# EAGLE schematic ThrusterShieldV1.1 (EAGLE 6.6.0)
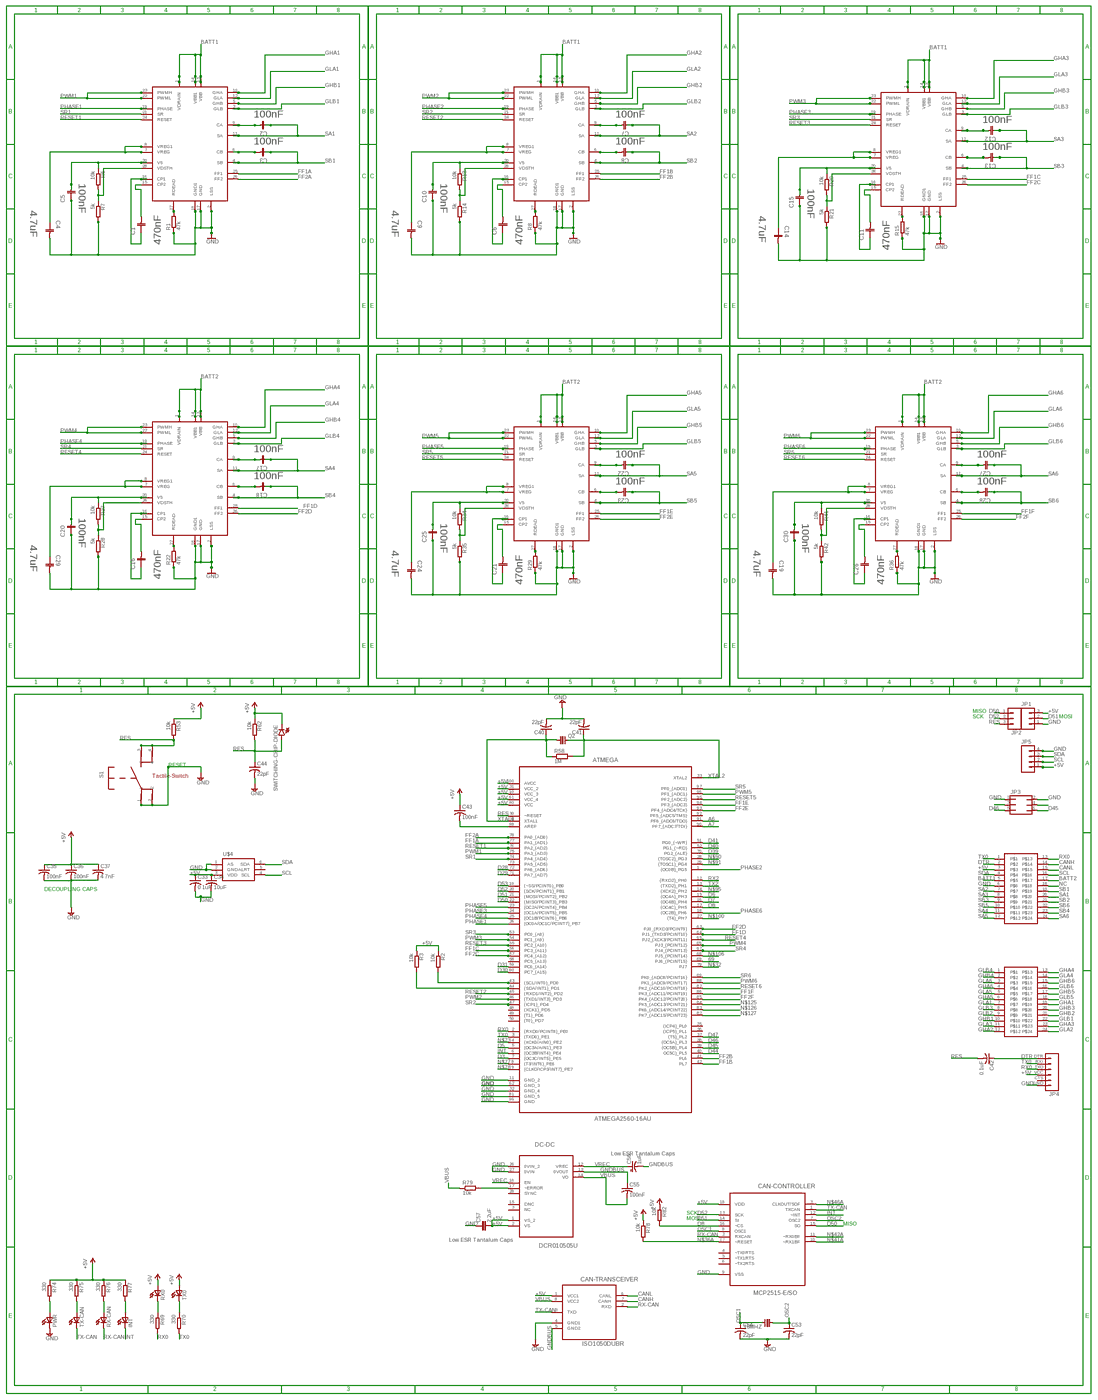
[diagram p0: schematic, sheet 1, overview]
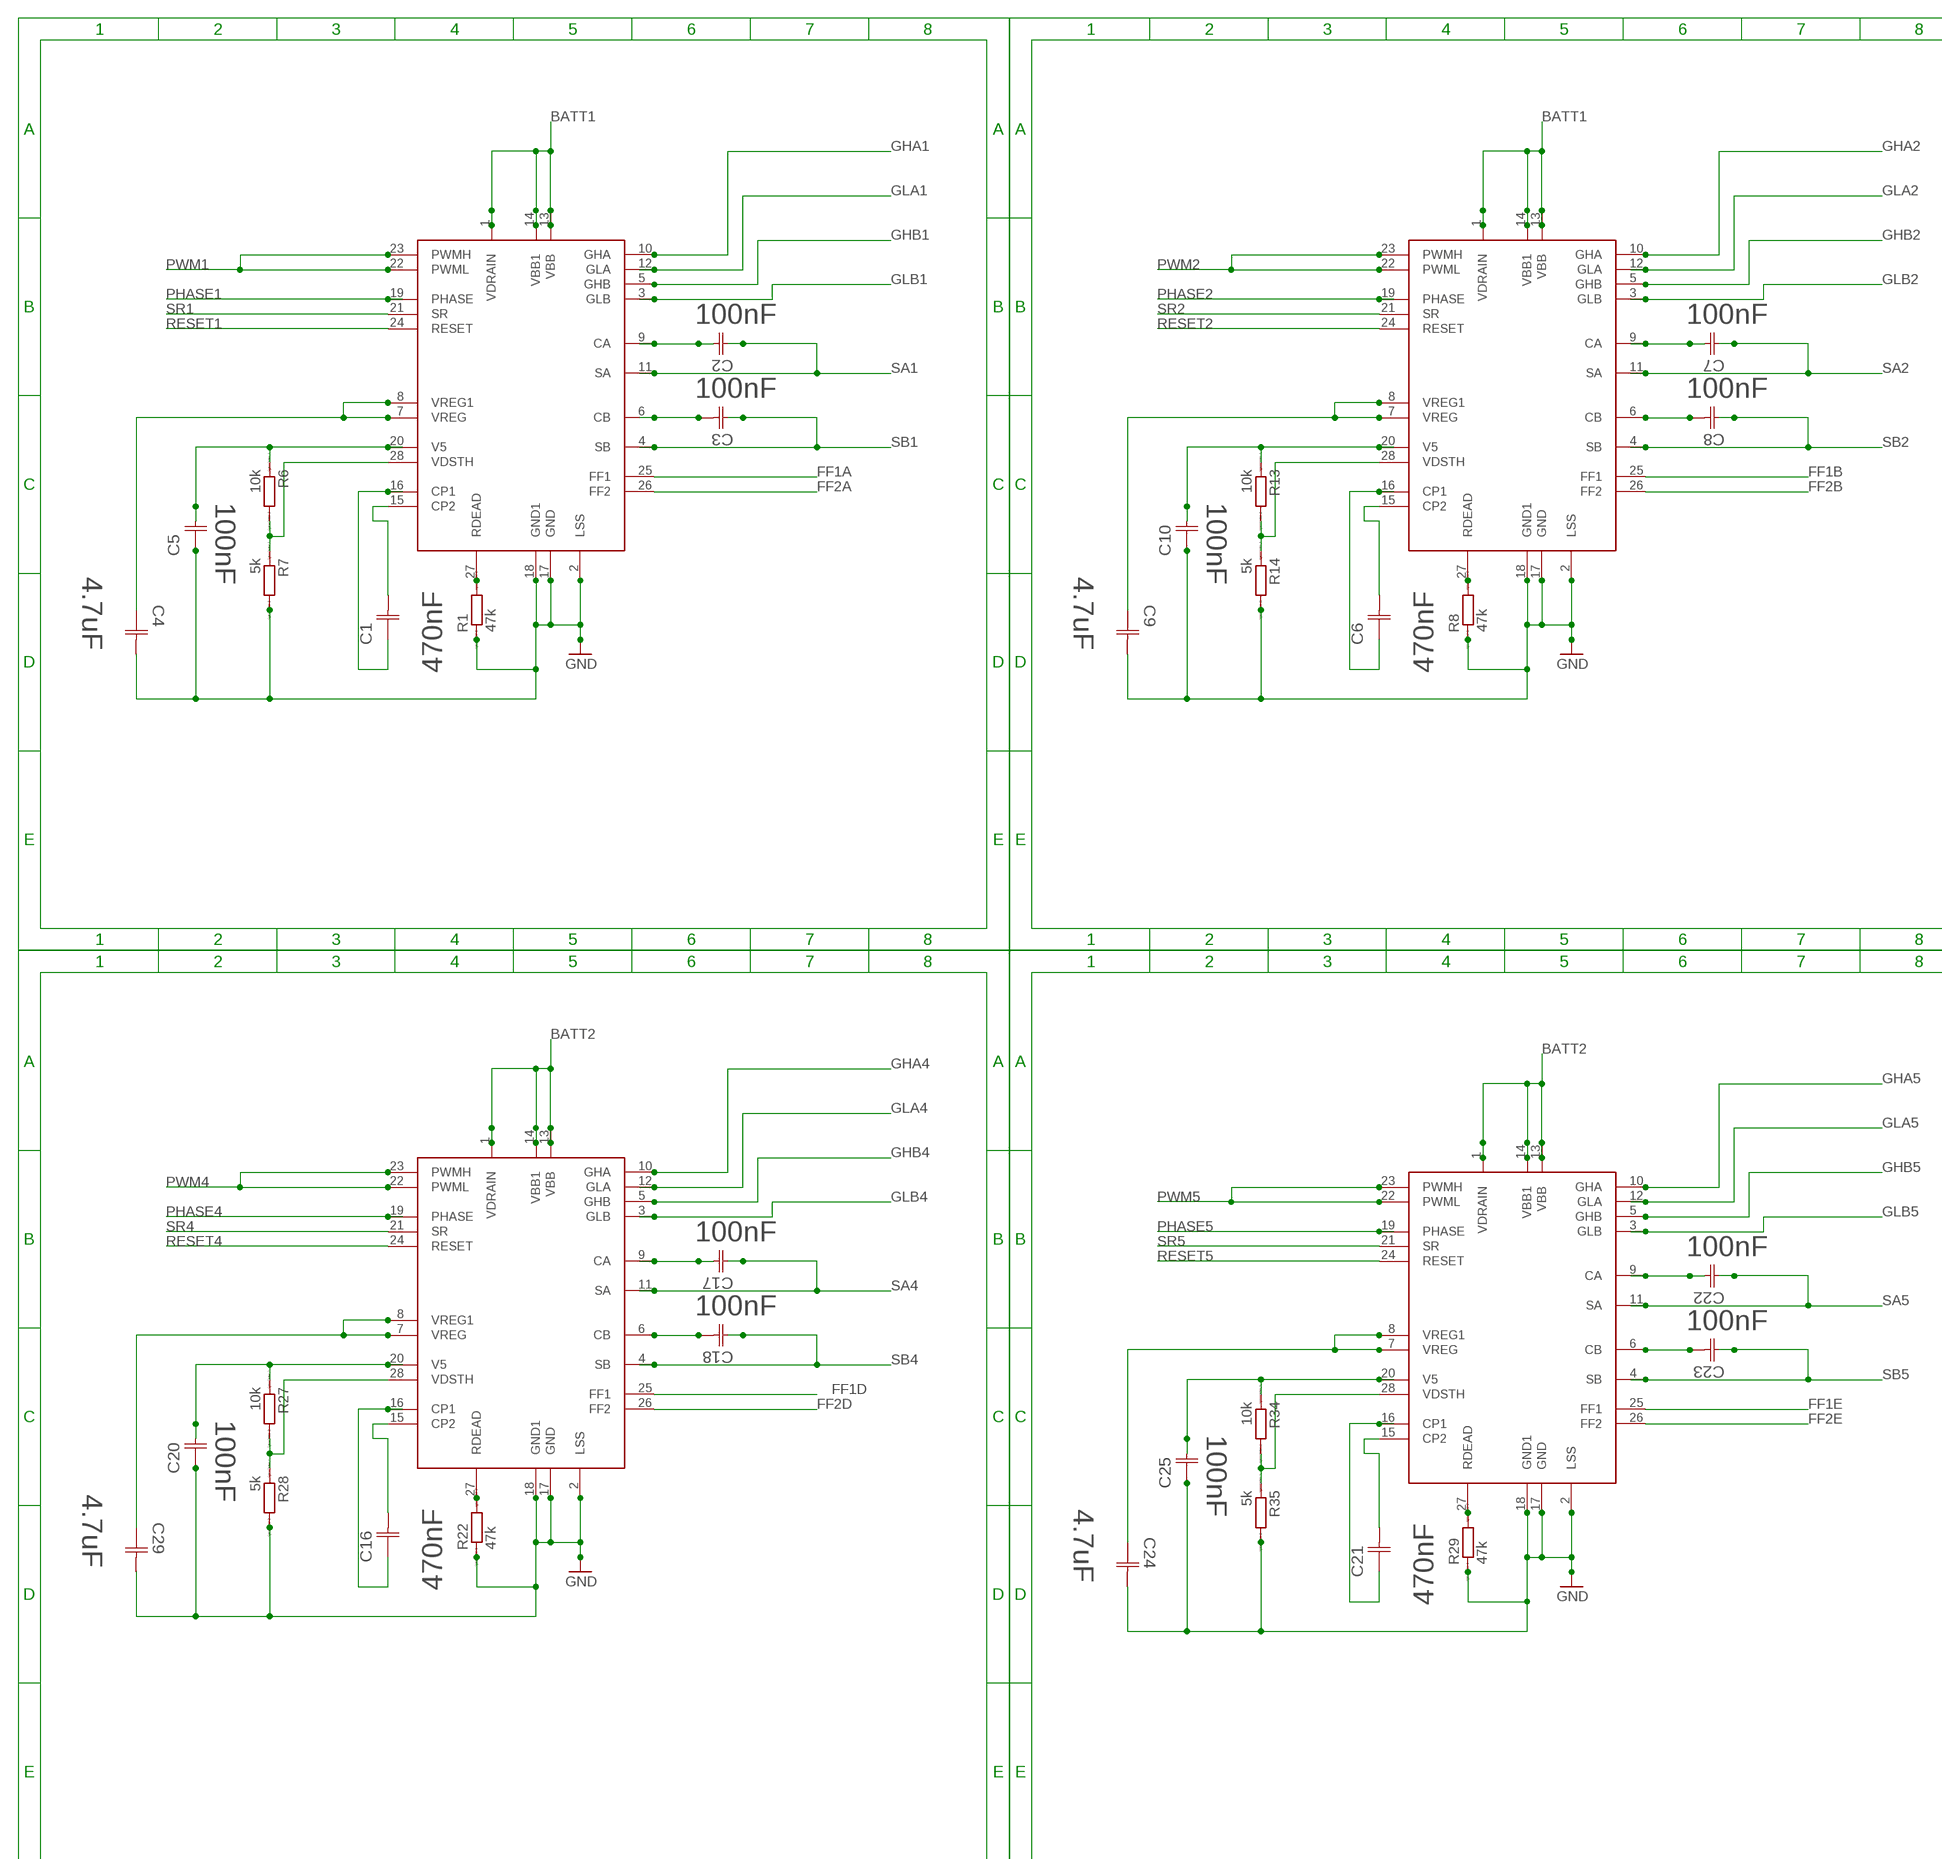
[diagram p1: schematic, sheet 1, part 1 of 4]
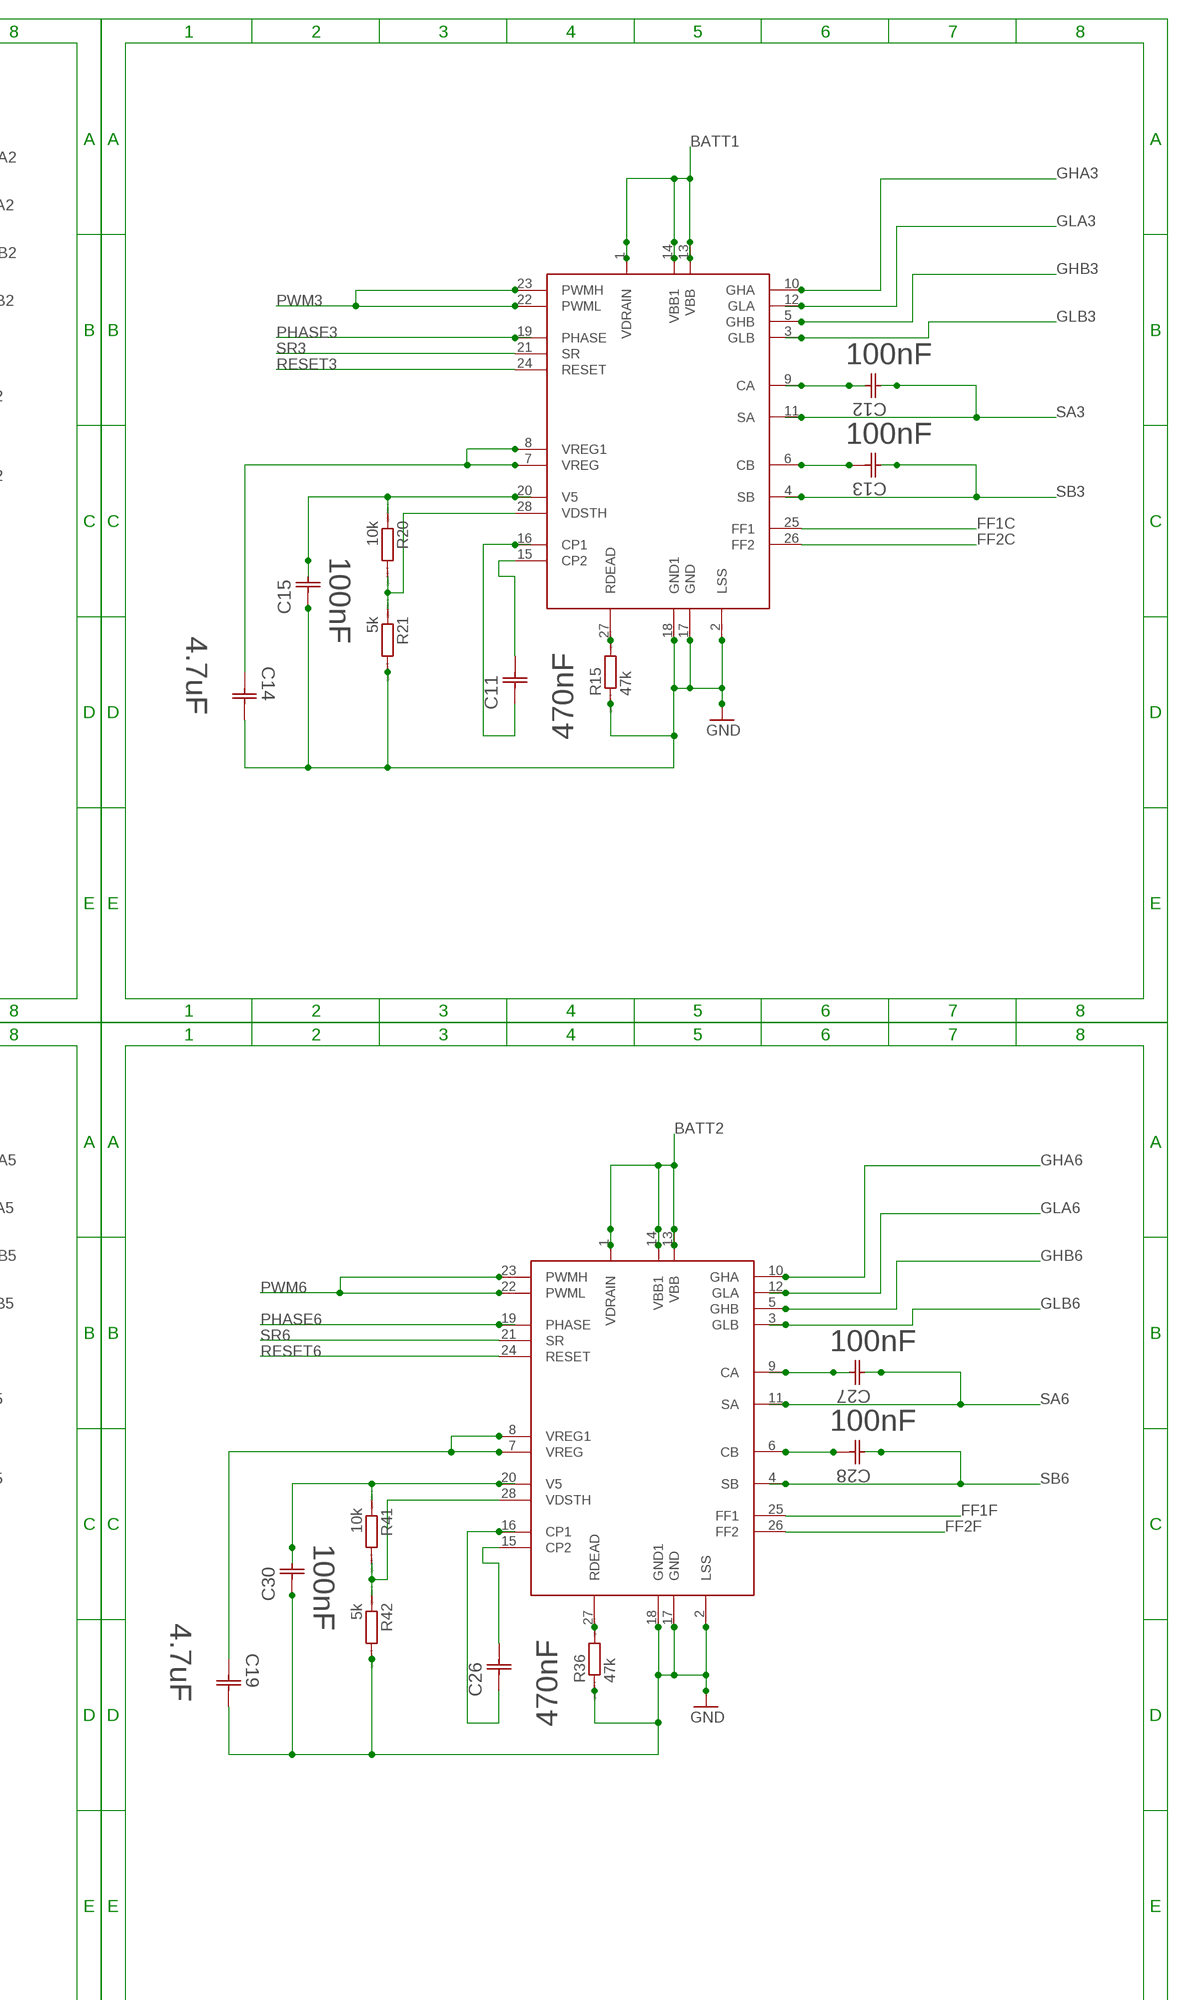
[diagram p2: schematic, sheet 1, part 2 of 4]
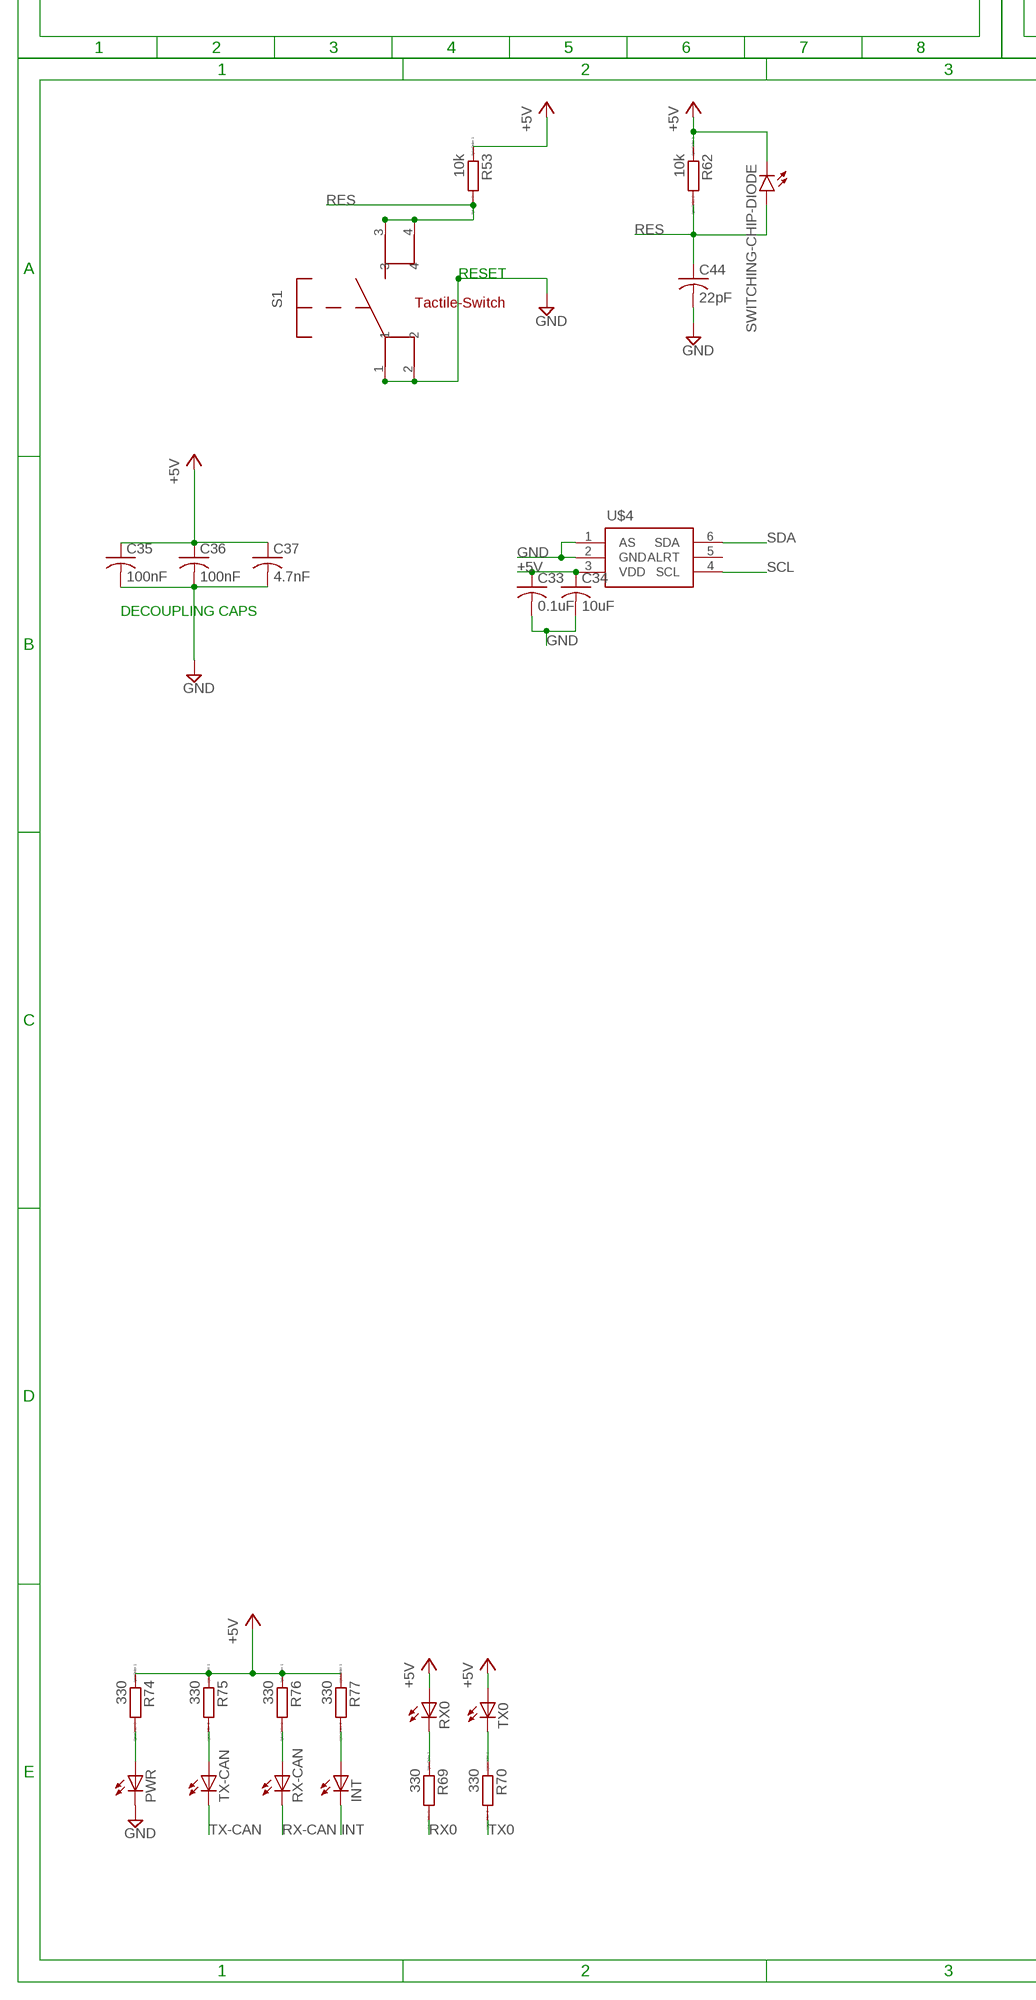
[diagram p3: schematic, sheet 1, part 3 of 4]
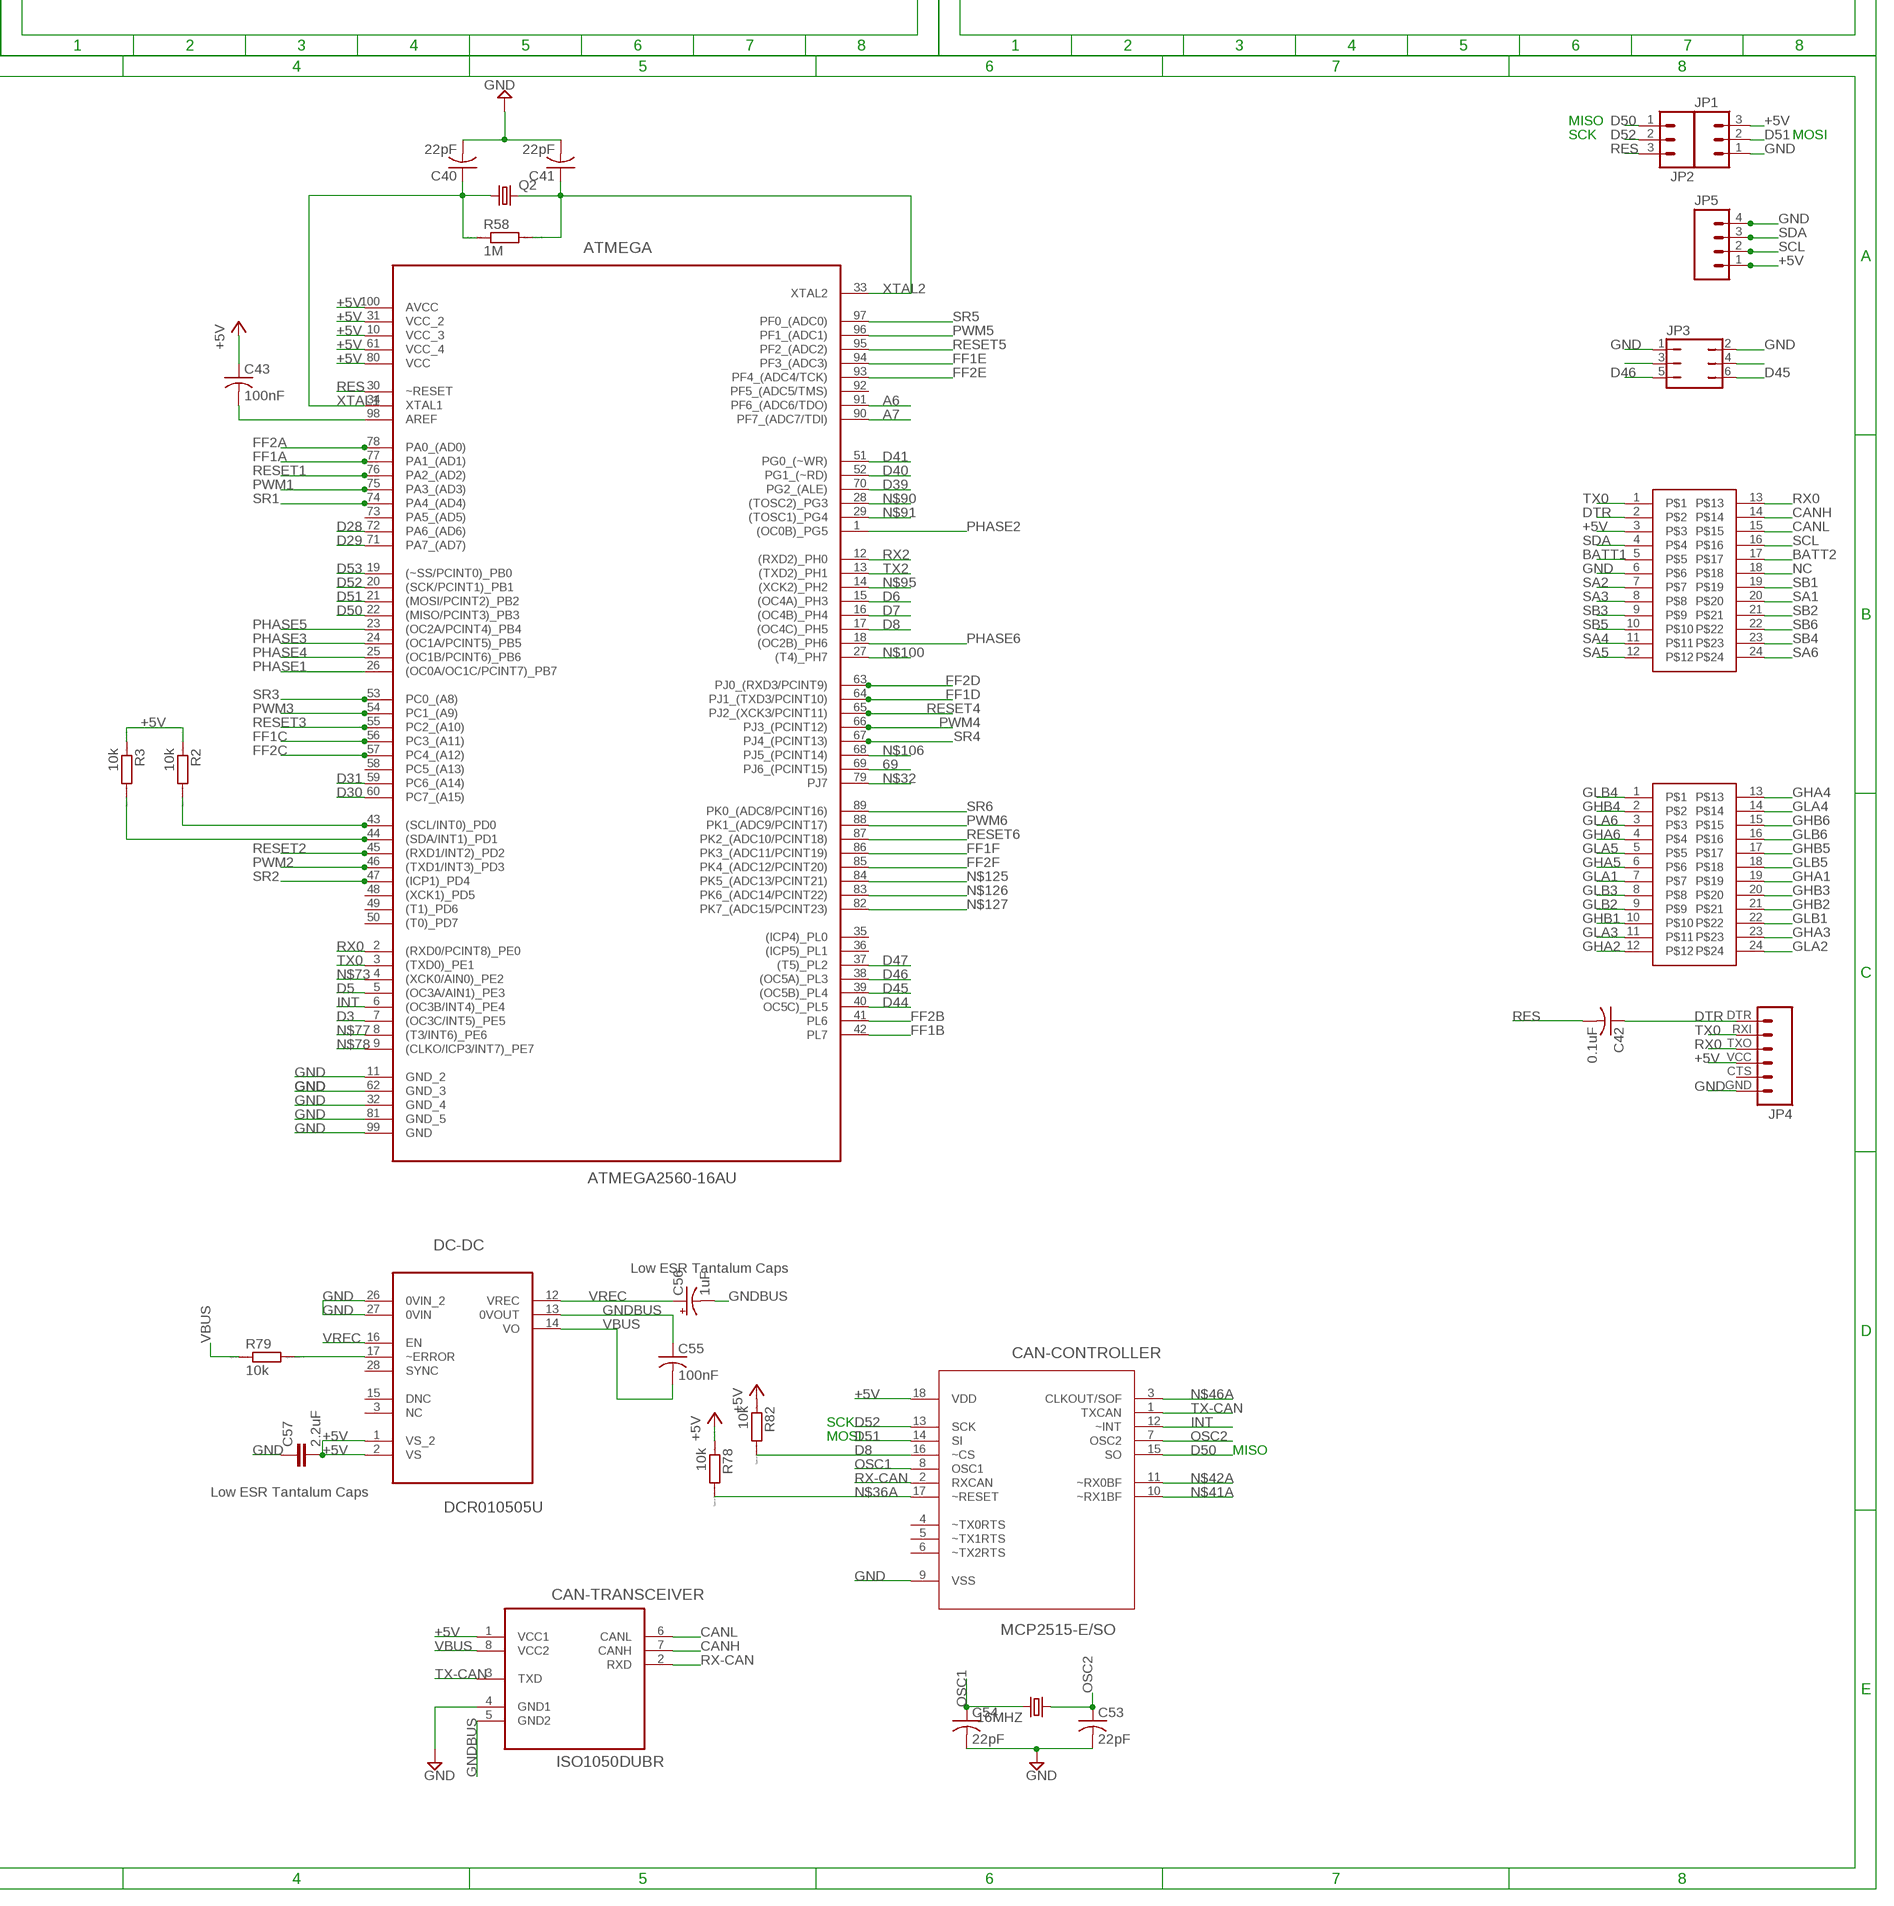
[diagram p4: schematic, sheet 1, part 4 of 4]

## Parts
16MHZ  CRYSTALHC49UP  [HC49UP]
ATMEGA  ATMEGA2560-16AU  [QFP50P1600X1600X120-100N]
C1  470nF  B37940K5100J60  [CAPC2013X70N]
C2  100nF  B37940K5100J60  [CAPC2013X70N]
C3  100nF  B37940K5100J60  [CAPC2013X70N]
C4  4.7uF  B37940K5100J60  [CAPC2013X70N]
C5  100nF  B37940K5100J60  [CAPC2013X70N]
C6  470nF  B37940K5100J60  [CAPC2013X70N]
C7  100nF  B37940K5100J60  [CAPC2013X70N]
C8  100nF  B37940K5100J60  [CAPC2013X70N]
C9  4.7uF  B37940K5100J60  [CAPC2013X70N]
C10  100nF  B37940K5100J60  [CAPC2013X70N]
C11  470nF  B37940K5100J60  [CAPC2013X70N]
C12  100nF  B37940K5100J60  [CAPC2013X70N]
C13  100nF  B37940K5100J60  [CAPC2013X70N]
C14  4.7uF  B37940K5100J60  [CAPC2013X70N]
C15  100nF  B37940K5100J60  [CAPC2013X70N]
C16  470nF  B37940K5100J60  [CAPC2013X70N]
C17  100nF  B37940K5100J60  [CAPC2013X70N]
C18  100nF  B37940K5100J60  [CAPC2013X70N]
C19  4.7uF  B37940K5100J60  [CAPC2013X70N]
C20  100nF  B37940K5100J60  [CAPC2013X70N]
C21  470nF  B37940K5100J60  [CAPC2013X70N]
C22  100nF  B37940K5100J60  [CAPC2013X70N]
C23  100nF  B37940K5100J60  [CAPC2013X70N]
C24  4.7uF  B37940K5100J60  [CAPC2013X70N]
C25  100nF  B37940K5100J60  [CAPC2013X70N]
C26  470nF  B37940K5100J60  [CAPC2013X70N]
C27  100nF  B37940K5100J60  [CAPC2013X70N]
C28  100nF  B37940K5100J60  [CAPC2013X70N]
C29  4.7uF  B37940K5100J60  [CAPC2013X70N]
C30  100nF  B37940K5100J60  [CAPC2013X70N]
C33  0.1uF  C-USC0805  [C0805]
C34  10uF  C-USC0805  [C0805]
C35  100nF  C-USC0805  [C0805]
C36  100nF  C-USC0805  [C0805]
C37  4.7nF  C-USC0805  [C0805]
C40  22pF  C-USC0805  [C0805]
C41  22pF  C-USC0805  [C0805]
C42  0.1uF  C-USC0805  [C0805]
C43  100nF  C-USC0805  [C0805]
C44  22pF  C-USC0805  [C0805]
C53  22pF  C-USC0805  [C0805]
C54  22pF  C-USC0805  [C0805]
C55  100nF  C-USC0805  [C0805]
C56  1uF  CAP_POL6032  [EIA6032]
C57  2.2uF  CAP0603-CAP  [0603-CAP]
CAN-CONTROLLER  MCP2515-E/SO  [SOIC127P1030X265-18N]
CAN-TRANSCEIVER  ISO1050DUBR  [SOIC254P1040X485-8N]
DC-DC  DCR010505U  [SOIC127P1032X265-12NA]
INT  LEDCHIP-LED0805  [CHIP-LED0805]
JP1  M03LOCK  [1X03_LOCK]
JP2  M03LOCK  [1X03_LOCK]
JP3  JP3Q  [JP3Q]
JP4  M06SIP  [1X06]
JP5  M04PTH  [1X04]
PWR  LEDCHIP-LED0805  [CHIP-LED0805]
Q2  CRYSTALHC49UP  [HC49UP]
R1  47k  R  [R0805]
R2  10k  R  [R0805]
R3  10k  R  [R0805]
R6  10k  R  [R0805]
R7  5k  R  [R0805]
R8  47k  R  [R0805]
R13  10k  R  [R0805]
R14  5k  R  [R0805]
R15  47k  R  [R0805]
R20  10k  R  [R0805]
R21  5k  R  [R0805]
R22  47k  R  [R0805]
R27  10k  R  [R0805]
R28  5k  R  [R0805]
R29  47k  R  [R0805]
R34  10k  R  [R0805]
R35  5k  R  [R0805]
R36  47k  R  [R0805]
R41  10k  R  [R0805]
R42  5k  R  [R0805]
R53  10k  R  [R0805]
R58  1M  R  [R0805]
R62  10k  R  [R0805]
R69  330  R  [R0805]
R70  330  R  [R0805]
R74  330  R  [R0805]
R75  330  R  [R0805]
R76  330  R  [R0805]
R77  330  R  [R0805]
R78  10k  R  [R0805]
R79  10k  R  [R0805]
R82  10k  R  [R0805]
RX0  LEDCHIP-LED0805  [CHIP-LED0805]
RX-CAN  LEDCHIP-LED0805  [CHIP-LED0805]
SWITCHING-CHIP-DIODE  LED1206  [LED-1206]
TX0  LEDCHIP-LED0805  [CHIP-LED0805]
TX-CAN  LEDCHIP-LED0805  [CHIP-LED0805]
U$1  15-91-0360  [15-91-0360]
U$2  15-91-0360  [15-91-0360]
U$4  AD7414  [SOT23-6]
U$25  A3941KLPTR-T  [TSSOP-28]
U$26  A3941KLPTR-T  [TSSOP-28]
U$27  A3941KLPTR-T  [TSSOP-28]
U$28  A3941KLPTR-T  [TSSOP-28]
U$29  A3941KLPTR-T  [TSSOP-28]
U$30  A3941KLPTR-T  [TSSOP-28]
U$35  B3FS-1000  [B3F2-1000]

## Nets
69: ATMEGA.69(PJ6_(PCINT15))
+5V: ATMEGA.10(VCC_3) ATMEGA.31(VCC_2) ATMEGA.61(VCC_4) ATMEGA.80(VCC) ATMEGA.100(AVCC) C33.1 C34.1 C35.1 C36.1 C37.1 C43.1 C57.2 CAN-CONTROLLER.18(VDD) CAN-TRANSCEIVER.1(VCC1) DC-DC.1(VS_2) DC-DC.2(VS) JP1.3 JP4.VCC JP5.1 R2.1 R3.1 R53.1 R62.1 R74.1 R75.1 R76.1 R77.1 R78.1 R82.1 RX0.A SWITCHING-CHIP-DIODE.C TX0.A U$1.3 U$4.3(VDD)
A6: ATMEGA.91(PF6_(ADC6/TDO))
A7: ATMEGA.90(PF7_(ADC7/TDI))
BATT1: U$1.5 U$25.1(VDRAIN) U$25.13(VBB) U$25.14(VBB1) U$26.1(VDRAIN) U$26.13(VBB) U$26.14(VBB1) U$27.1(VDRAIN) U$27.13(VBB) U$27.14(VBB1)
BATT2: U$1.17 U$28.1(VDRAIN) U$28.13(VBB) U$28.14(VBB1) U$29.1(VDRAIN) U$29.13(VBB) U$29.14(VBB1) U$30.1(VDRAIN) U$30.13(VBB) U$30.14(VBB1)
CANH: CAN-TRANSCEIVER.7(CANH) U$1.14
CANL: CAN-TRANSCEIVER.6(CANL) U$1.15
D3: ATMEGA.7((OC3C/INT5)_PE5)
D5: ATMEGA.5((OC3A/AIN1)_PE3)
D6: ATMEGA.15((OC4A)_PH3)
D7: ATMEGA.16((OC4B)_PH4)
D8: ATMEGA.17((OC4C)_PH5) CAN-CONTROLLER.16(~CS) R82.2
D28: ATMEGA.72(PA6_(AD6))
D29: ATMEGA.71(PA7_(AD7))
D30: ATMEGA.60(PC7_(A15))
D31: ATMEGA.59(PC6_(A14))
D39: ATMEGA.70(PG2_(ALE))
D40: ATMEGA.52(PG1_(~RD))
D41: ATMEGA.51(PG0_(~WR))
D44: ATMEGA.40(OC5C)_PL5)
D45: ATMEGA.39((OC5B)_PL4) JP3.6
D46: ATMEGA.38((OC5A)_PL3) JP3.5
D47: ATMEGA.37((T5)_PL2)
D50: ATMEGA.22((MISO/PCINT3)_PB3) CAN-CONTROLLER.15(SO) JP2.1
D51: ATMEGA.21((MOSI/PCINT2)_PB2) CAN-CONTROLLER.14(SI) JP1.2
D52: ATMEGA.20((SCK/PCINT1)_PB1) CAN-CONTROLLER.13(SCK) JP2.2
D53: ATMEGA.19((~SS/PCINT0)_PB0)
DTR: C42.1 JP4.DTR U$1.2
FF1A: ATMEGA.77(PA1_(AD1)) U$25.25(FF1)
FF1B: ATMEGA.42(PL7) U$26.25(FF1)
FF1C: ATMEGA.56(PC3_(A11)) U$27.25(FF1)
FF1D: ATMEGA.64(PJ1_(TXD3/PCINT10)) U$28.25(FF1)
FF1E: ATMEGA.94(PF3_(ADC3)) U$29.25(FF1)
FF1F: ATMEGA.86(PK3_(ADC11/PCINT19)) U$30.25(FF1)
FF2A: ATMEGA.78(PA0_(AD0)) U$25.26(FF2)
FF2B: ATMEGA.41(PL6) U$26.26(FF2)
FF2C: ATMEGA.57(PC4_(A12)) U$27.26(FF2)
FF2D: ATMEGA.63(PJ0_(RXD3/PCINT9)) U$28.26(FF2)
FF2E: ATMEGA.93(PF4_(ADC4/TCK)) U$29.26(FF2)
FF2F: ATMEGA.85(PK4_(ADC12/PCINT20)) U$30.26(FF2)
GHA1: U$2.19 U$25.10(GHA)
GHA2: U$2.12 U$26.10(GHA)
GHA3: U$2.23 U$27.10(GHA)
GHA4: U$2.13 U$28.10(GHA)
GHA5: U$2.6 U$29.10(GHA)
GHA6: U$2.4 U$30.10(GHA)
GHB1: U$2.10 U$25.5(GHB)
GHB2: U$2.21 U$26.5(GHB)
GHB3: U$2.20 U$27.5(GHB)
GHB4: U$2.2 U$28.5(GHB)
GHB5: U$2.17 U$29.5(GHB)
GHB6: U$2.15 U$30.5(GHB)
GLA1: U$2.7 U$25.12(GLA)
GLA2: U$2.24 U$26.12(GLA)
GLA3: U$2.11 U$27.12(GLA)
GLA4: U$2.14 U$28.12(GLA)
GLA5: U$2.5 U$29.12(GLA)
GLA6: U$2.3 U$30.12(GLA)
GLB1: U$2.22 U$25.3(GLB)
GLB2: U$2.9 U$26.3(GLB)
GLB3: U$2.8 U$27.3(GLB)
GLB4: U$2.1 U$28.3(GLB)
GLB5: U$2.18 U$29.3(GLB)
GLB6: U$2.16 U$30.3(GLB)
GND: ATMEGA.11(GND_2) ATMEGA.32(GND_4) ATMEGA.62(GND_3) ATMEGA.81(GND_5) ATMEGA.99(GND) C4.2(C2) C5.1(C1) C9.2(C2) C10.1(C1) C14.2(C2) C15.1(C1) C19.2(C2) C20.1(C1) C24.2(C2) C25.1(C1) C29.2(C2) C30.1(C1) C33.2 C34.2 C35.2 C36.2 C37.2 C40.2 C41.2 C44.2 C53.2 C54.2 C57.1 CAN-CONTROLLER.9(VSS) CAN-TRANSCEIVER.4(GND1) DC-DC.26(0VIN_2) DC-DC.27(0VIN) JP1.1 JP3.1 JP3.2 JP4.GND JP5.4 PWR.C R1.1 R7.2 R8.1 R14.2 R15.1 R21.2 R22.1 R28.2 R29.1 R35.2 R36.1 R42.2 U$1.6 U$4.1(AS) U$4.2(GND) U$25.2(LSS) U$25.17(GND) U$25.18(GND1) U$26.2(LSS) U$26.17(GND) U$26.18(GND1) U$27.2(LSS) U$27.17(GND) U$27.18(GND1) U$28.2(LSS) U$28.17(GND) U$28.18(GND1) U$29.2(LSS) U$29.17(GND) U$29.18(GND1) U$30.2(LSS) U$30.17(GND) U$30.18(GND1) U$35.1 U$35.2
GNDBUS: C55.1 C56.P$2(-) CAN-TRANSCEIVER.5(GND2) DC-DC.13(0VOUT)
INT: ATMEGA.6((OC3B/INT4)_PE4) CAN-CONTROLLER.12(~INT) INT.C
N$1: R1.2 U$25.27(RDEAD)
N$3: C1.1(C1) U$25.16(CP1)
N$4: C1.2(C2) U$25.15(CP2)
N$5: C3.2(C2) U$25.6(CB)
N$6: C2.2(C2) U$25.9(CA)
N$7: JP3.4
N$10: C4.1(C1) U$25.7(VREG) U$25.8(VREG1)
N$11: C5.2(C2) R6.1 U$25.20(V5)
N$12: R6.2 R7.1 U$25.28(VDSTH)
N$13: R8.2 U$26.27(RDEAD)
N$14: C8.2(C2) U$26.6(CB)
N$15: C7.2(C2) U$26.9(CA)
N$16: C9.1(C1) U$26.7(VREG) U$26.8(VREG1)
N$17: JP3.3
N$21: C6.1(C1) U$26.16(CP1)
N$22: C6.2(C2) U$26.15(CP2)
N$23: C10.2(C2) R13.1 U$26.20(V5)
N$24: R13.2 R14.1 U$26.28(VDSTH)
N$25: R15.2 U$27.27(RDEAD)
N$26: C13.2(C2) U$27.6(CB)
N$27: C12.2(C2) U$27.9(CA)
N$28: C14.1(C1) U$27.7(VREG) U$27.8(VREG1)
N$32: ATMEGA.79(PJ7)
N$33: C11.1(C1) U$27.16(CP1)
N$34: C11.2(C2) U$27.15(CP2)
N$35: C15.2(C2) R20.1 U$27.20(V5)
N$36: R20.2 R21.1 U$27.28(VDSTH)
N$36A: CAN-CONTROLLER.17(~RESET) R78.2
N$37: R22.2 U$28.27(RDEAD)
N$38: C18.2(C2) U$28.6(CB)
N$39: C17.2(C2) U$28.9(CA)
N$40: C29.1(C1) U$28.7(VREG) U$28.8(VREG1)
N$41A: CAN-CONTROLLER.10(~RX1BF)
N$42A: CAN-CONTROLLER.11(~RX0BF)
N$45: C16.1(C1) U$28.16(CP1)
N$46: C16.2(C2) U$28.15(CP2)
N$46A: CAN-CONTROLLER.3(CLKOUT/SOF)
N$47: C20.2(C2) R27.1 U$28.20(V5)
N$48: R27.2 R28.1 U$28.28(VDSTH)
N$49: R29.2 U$29.27(RDEAD)
N$50: C23.2(C2) U$29.6(CB)
N$51: C22.2(C2) U$29.9(CA)
N$52: C24.1(C1) U$29.7(VREG) U$29.8(VREG1)
N$57: C21.1(C1) U$29.16(CP1)
N$58: C21.2(C2) U$29.15(CP2)
N$59: C25.2(C2) R34.1 U$29.20(V5)
N$60: R34.2 R35.1 U$29.28(VDSTH)
N$61: R36.2 U$30.27(RDEAD)
N$62: C28.2(C2) U$30.6(CB)
N$63: C27.2(C2) U$30.9(CA)
N$64: C19.1(C1) U$30.7(VREG) U$30.8(VREG1)
N$69: C26.1(C1) U$30.16(CP1)
N$70: C26.2(C2) U$30.15(CP2)
N$71: C30.2(C2) R41.1 U$30.20(V5)
N$72: R41.2 R42.1 U$30.28(VDSTH)
N$73: ATMEGA.4((XCK0/AIN0)_PE2)
N$77: ATMEGA.8((T3/INT6)_PE6)
N$78: ATMEGA.9((CLKO/ICP3/INT7)_PE7)
N$86: ATMEGA.98(AREF) C43.2
N$90: ATMEGA.28((TOSC2)_PG3)
N$91: ATMEGA.29((TOSC1)_PG4)
N$92: R69.1 RX0.C
N$93: R70.1 TX0.C
N$95: ATMEGA.14((XCK2)_PH2)
N$100: ATMEGA.27((T4)_PH7)
N$106: ATMEGA.68(PJ5_(PCINT14))
N$108: PWR.A R74.2
N$109: R75.2 TX-CAN.A
N$110: R76.2 RX-CAN.A
N$111: INT.A R77.2
N$112: DC-DC.17(~ERROR) R79.2
N$125: ATMEGA.84(PK5_(ADC13/PCINT21))
N$126: ATMEGA.83(PK6_(ADC14/PCINT22))
N$127: ATMEGA.82(PK7_(ADC15/PCINT23))
NC: U$1.18
OSC1: 16MHZ.2 C54.1 CAN-CONTROLLER.8(OSC1)
OSC2: 16MHZ.1 C53.1 CAN-CONTROLLER.7(OSC2)
PHASE1: ATMEGA.26((OC0A/OC1C/PCINT7)_PB7) U$25.19(PHASE)
PHASE2: ATMEGA.1((OC0B)_PG5) U$26.19(PHASE)
PHASE3: ATMEGA.24((OC1A/PCINT5)_PB5) U$27.19(PHASE)
PHASE4: ATMEGA.25((OC1B/PCINT6)_PB6) U$28.19(PHASE)
PHASE5: ATMEGA.23((OC2A/PCINT4)_PB4) U$29.19(PHASE)
PHASE6: ATMEGA.18((OC2B)_PH6) U$30.19(PHASE)
PWM1: ATMEGA.75(PA3_(AD3)) U$25.22(PWML) U$25.23(PWMH)
PWM2: ATMEGA.46((TXD1/INT3)_PD3) U$26.22(PWML) U$26.23(PWMH)
PWM3: ATMEGA.54(PC1_(A9)) U$27.22(PWML) U$27.23(PWMH)
PWM4: ATMEGA.66(PJ3_(PCINT12)) U$28.22(PWML) U$28.23(PWMH)
PWM5: ATMEGA.96(PF1_(ADC1)) U$29.22(PWML) U$29.23(PWMH)
PWM6: ATMEGA.88(PK1_(ADC9/PCINT17)) U$30.22(PWML) U$30.23(PWMH)
RES: ATMEGA.30(~RESET) C42.2 C44.1 JP2.3 R53.2 R62.2 SWITCHING-CHIP-DIODE.A U$35.3 U$35.4
RESET1: ATMEGA.76(PA2_(AD2)) U$25.24(RESET)
RESET2: ATMEGA.45((RXD1/INT2)_PD2) U$26.24(RESET)
RESET3: ATMEGA.55(PC2_(A10)) U$27.24(RESET)
RESET4: ATMEGA.65(PJ2_(XCK3/PCINT11)) U$28.24(RESET)
RESET5: ATMEGA.95(PF2_(ADC2)) U$29.24(RESET)
RESET6: ATMEGA.87(PK2_(ADC10/PCINT18)) U$30.24(RESET)
RX0: ATMEGA.2((RXD0/PCINT8)_PE0) JP4.TXO R69.2 U$1.13
RX2: ATMEGA.12((RXD2)_PH0)
RX-CAN: CAN-CONTROLLER.2(RXCAN) CAN-TRANSCEIVER.2(RXD) RX-CAN.C
SA1: C2.1(C1) U$1.20 U$25.11(SA)
SA2: C7.1(C1) U$1.7 U$26.11(SA)
SA3: C12.1(C1) U$1.8 U$27.11(SA)
SA4: C17.1(C1) U$1.11 U$28.11(SA)
SA5: C22.1(C1) U$1.12 U$29.11(SA)
SA6: C27.1(C1) U$1.24 U$30.11(SA)
SB1: C3.1(C1) U$1.19 U$25.4(SB)
SB2: C8.1(C1) U$1.21 U$26.4(SB)
SB3: C13.1(C1) U$1.9 U$27.4(SB)
SB4: C18.1(C1) U$1.23 U$28.4(SB)
SB5: C23.1(C1) U$1.10 U$29.4(SB)
SB6: C28.1(C1) U$1.22 U$30.4(SB)
SCL: ATMEGA.43((SCL/INT0)_PD0) JP5.2 R2.2 U$1.16 U$4.4(SCL)
SDA: ATMEGA.44((SDA/INT1)_PD1) JP5.3 R3.2 U$1.4 U$4.6(SDA)
SR1: ATMEGA.74(PA4_(AD4)) U$25.21(SR)
SR2: ATMEGA.47((ICP1)_PD4) U$26.21(SR)
SR3: ATMEGA.53(PC0_(A8)) U$27.21(SR)
SR4: ATMEGA.67(PJ4_(PCINT13)) U$28.21(SR)
SR5: ATMEGA.97(PF0_(ADC0)) U$29.21(SR)
SR6: ATMEGA.89(PK0_(ADC8/PCINT16)) U$30.21(SR)
TX0: ATMEGA.3((TXD0)_PE1) JP4.RXI R70.2 U$1.1
TX2: ATMEGA.13((TXD2)_PH1)
TX-CAN: CAN-CONTROLLER.1(TXCAN) CAN-TRANSCEIVER.3(TXD) TX-CAN.C
VBUS: C55.2 CAN-TRANSCEIVER.8(VCC2) DC-DC.14(VO) R79.1
VREC: C56.P$1(+) DC-DC.12(VREC) DC-DC.16(EN)
XTAL1: ATMEGA.34(XTAL1) C40.1 Q2.1 R58.1
XTAL2: ATMEGA.33(XTAL2) C41.1 Q2.2 R58.2
Unconnected: ATMEGA.35((ICP4)_PL0) ATMEGA.36((ICP5)_PL1) ATMEGA.48((XCK1)_PD5) ATMEGA.49((T1)_PD6) ATMEGA.50((T0)_PD7) ATMEGA.58(PC5_(A13)) ATMEGA.73(PA5_(AD5)) ATMEGA.92(PF5_(ADC5/TMS)) CAN-CONTROLLER.4(~TX0RTS) CAN-CONTROLLER.5(~TX1RTS) CAN-CONTROLLER.6(~TX2RTS) DC-DC.3(NC) DC-DC.15(DNC) DC-DC.28(SYNC) JP4.CTS U$4.5(ALRT)

## Notes on the sheet
- MISO
- SCK | MOSI
- RESET
- DECOUPLING CAPS
- Low ESR Tantalum Caps
- SCK
- MOSI
- MISO
- Low ESR Tantalum Caps

## Library data of the parts
16MHZ Q2 = crystal:CRYSTAL: CRYSTAL; OC_FARNELL: unknown; OC_NEWARK: unknown
ATMEGA = ATmega2560:ATMEGA2560-16AU: Microcontroller; DESCRIPTION: Microcontroller; MPN: ATMEGA2560-16AU; OC_FARNELL: 1288330; OC_NEWARK: 23M5051; PACKAGE: LQFP-100; SUPPLIER: ATMEL
C1-C30 = Epcos_By_element14_Batch_1:B37940K5100J60: CAPACITOR, 0805; MPN: B37940K5100J60; OC_FARNELL: 9753559; OC_NEWARK: -; SUPPLIER: Epcos; TOLERANCE: ±5%; VALUE: 10pF; VOLTAGERATING: 50V
C33-C37 C40-C44 C53-C55 = resistor:C-US: CAPACITOR, American symbol
C56 = SparkFun-Passives:CAP_POL: Capacitor Polarized These are standard SMD and PTH capacitors. Normally 10uF, 47uF, and 100uF in electrolytic and tantalum varieties. Always verify the external diameter of the through hole cap, it varies with capacity, voltage, and manufacturer. The EIA devices should be standard.
C57 = SparkFun-Passives:CAP: Capacitor Standard 0603 ceramic capacitor, and 0.1" leaded capacitor.
CAN-CONTROLLER = CAN-Controller-Library:MCP2515-E/SO: Stand-Alone CAN Controller; DESCRIPTION: IC CAN CONTROLLER; MPN: MCP2515-E/SO; OC_FARNELL: 1605565; OC_NEWARK: 29H7134; PACKAGE: SOIC-18; SUPPLIER: Microchip
CAN-TRANSCEIVER = CAN-Controller-Library:ISO1050DUBR: ISOLATED CAN TRANSCEIVER; MPN: ISO1050DUBR; OC_FARNELL: 2118645; OC_NEWARK: 14R9899; PACKAGE: DIP-8; SUPPLIER: TEXAS INSTRUMENTS
DC-DC = CAN-Controller-Library:DCR010505U: REGULATED DC/DC CONVERTERS; MPN: DCR010505U; OC_FARNELL: 1212384; OC_NEWARK: 84K1268; PACKAGE: SSOP-12; SUPPLIER: TEXAS INSTRUMENTS
INT PWR RX0 RX-CAN TX0 TX-CAN = led:LED: LED OSRAM: - CHIPLED LG R971, LG N971, LY N971, LG Q971, LY Q971, LO R971, LY R971 LH N974, LH R974 LS Q976, LO Q976, LY Q976 LO Q996 - Hyper CHIPLED LW Q18S LB Q993, LB Q99A, LB R99A - SideLED LS A670, LO A670, LY A670, LG A670, LP A670 LB A673, LV A673, LT A673, LW A673 LH A674 LY A675 LS A676, LA A676, LO A676, LY A676, LW A676 LS A679, LY A679, LG A679 - Hyper Micro SIDELED® LS Y876, LA Y876, LO Y876, LY Y876 LT Y87S - SmartLED LW L88C, LW L88S LB L89C, LB L89S, LG L890 LS L89K, LO L89K, LY L89K LS L896, LA L896, LO L896, LY L896 - TOPLED LS T670, LO T670, LY T670, LG T670, LP T670 LSG T670, LSP T670, LSY T670, LOP T670, LYG T670 LG T671, LOG T671, LSG T671 LB T673, LV T673, LT T673, LW T673 LH T674 LS T676, LA T676, LO T676, LY T676, LB T676, LH T676, LSB T676, LW T676 LB T67C, LV T67C, LT T67C, LS T67K, LO T67K, LY T67K, LW E67C LS E67B, LA E67B, LO E67B, LY E67B, LB E67C, LV E67C, LT E67C LW T67C LS T679, LY T679, LG T679 LS T770, LO T770, LY T770, LG T770, LP T770 LB T773, LV T773, LT T773, LW T773 LH T774 LS E675, LA E675, LY E675, LS T675 LS T776, LA T776, LO T776, LY T776, LB T776 LHGB T686 LT T68C, LB T68C - Hyper Mini TOPLED® LB M676 - Mini TOPLED Santana® LG M470 LS M47K, LO M47K, LY M47K Source: http://www.osram.convergy.de LUXEON: - LUMILED® LXK2-PW12-R00, LXK2-PW12-S00, LXK2-PW14-U00, LXK2-PW14-V00 LXK2-PM12-R00, LXK2-PM12-S00, LXK2-PM14-U00 LXK2-PE12-Q00, LXK2-PE12-R00, LXK2-PE12-S00, LXK2-PE14-T00, LXK2-PE14-U00 LXK2-PB12-K00, LXK2-PB12-L00, LXK2-PB12-M00, LXK2-PB14-N00, LXK2-PB14-P00, LXK2-PB14-Q00 LXK2-PR12-L00, LXK2-PR12-M00, LXK2-PR14-Q00, LXK2-PR14-R00 LXK2-PD12-Q00, LXK2-PD12-R00, LXK2-PD12-S00 LXK2-PH12-R00, LXK2-PH12-S00 LXK2-PL12-P00, LXK2-PL12-Q00, LXK2-PL12-R00 Source: www.luxeon.com KINGBRIGHT: KA-3528ASYC Source: www.kingbright.com
JP1 JP2 = SparkFun-Connectors:M03: Header 3 Standard 3-pin 0.1" header. Use with straight break away headers (SKU : PRT-00116), right angle break away headers (PRT-00553), swiss pins (PRT-00743), machine pins (PRT-00117), and female headers (PRT-00115). Molex polarized connector foot print use with SKU : PRT-08232 with associated crimp pins and housings.
JP3 = jumper:JP3Q: JUMPER
JP4 = SparkFun-Connectors:M06: Header 6 Standard 6-pin 0.1" header. Use with straight break away headers (SKU : PRT-00116), right angle break away headers (PRT-00553), swiss pins (PRT-00743), machine pins (PRT-00117), and female headers (PRT-00115). Molex polarized connector foot print use with SKU : PRT-08094 with associated crimp pins and housings. NOTES ON THE VARIANTS LOCK and LOCK_LONGPADS... This footprint was designed to help hold the alignment of a through-hole component (i.e. 6-pin header) while soldering it into place. You may notice that each hole has been shifted either up or down by 0.005 of an inch from it's more standard position (which is a perfectly straight line). This slight alteration caused the pins (the squares in the middle) to touch the edges of the holes. Because they are alternating, it causes a "brace" to hold the component in place. 0.005 has proven to be the perfect amount of "off-center" position when using our standard breakaway headers. Although looks a little odd when you look at the bare footprint, once you have a header in there, the alteration is very hard to notice. Also,if you push a header all the way into place, it is covered up entirely on the bottom side. This idea of altering the position of holes to aid alignment will be further integrated into the Sparkfun Library for other footprints. It can help hold any component with 3 or more connection pins.
JP5 = SparkFun-Connectors:M04: Header 4 Standard 4-pin 0.1" header. Use with straight break away headers (SKU : PRT-00116), right angle break away headers (PRT-00553), swiss pins (PRT-00743), machine pins (PRT-00117), and female headers (PRT-00115). Molex polarized connector foot print use with SKU : PRT-08231 with associated crimp pins and housings. 1MM SMD Version SKU: PRT-10208
R1-R3 R6-R8 R13-R15 R20-R22 R27-R29 R34-R36 R41 R42 R53 R58 R62 R69 R70 R74-R79 R82 = eagle-ltspice:R: RESISTOR, European symbol; SPICEMODEL: NONE; SPICEPREFIX: R
SWITCHING-CHIP-DIODE = SparkFun-LED:LED: LEDs Standard schematic elements and footprints for 5mm, 3mm, 1206, and 0603 sized LEDs. 5mm - Spark Fun Electronics SKU : COM-00529 (and others)
U$1 U$2 = bbauv:15-91-0360: 2.54mm Pitch C-Grid® Header, Surface Mount, Dual Row, Vertical, 36 Circuits, 0.38µm Gold (Au) Selective Plating
U$4 = bbauv:AD7414: ±0.5°C Accurate, 10-Bit Digital Temperature Sensors in SOT-23 The AD7414/AD7415 are complete temperature monitoring systems in 6-lead and 5-lead SOT-23 packages. They contain a band gap temperature sensor and a 10-bit ADC to monitor and digitize the temperature reading to a resolution of 0.25°C.
U$25-U$30 = bbauv:A3941KLPTR-T
U$35 = B3FS-1000:B3FS-1000